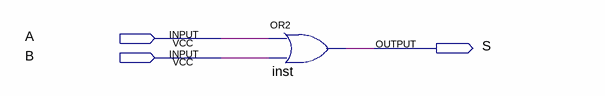
[diagram p0: schematic sheet]
// Quartus schematic OU.bdf as structural Verilog: 1 symbols, 3 pins
module OU (
  input  A,
  input  B,
  output S
);

  or inst (S, A, B);
endmodule
